# EAGLE design PoEInjector1ChUnregulated (EAGLE 5.09)
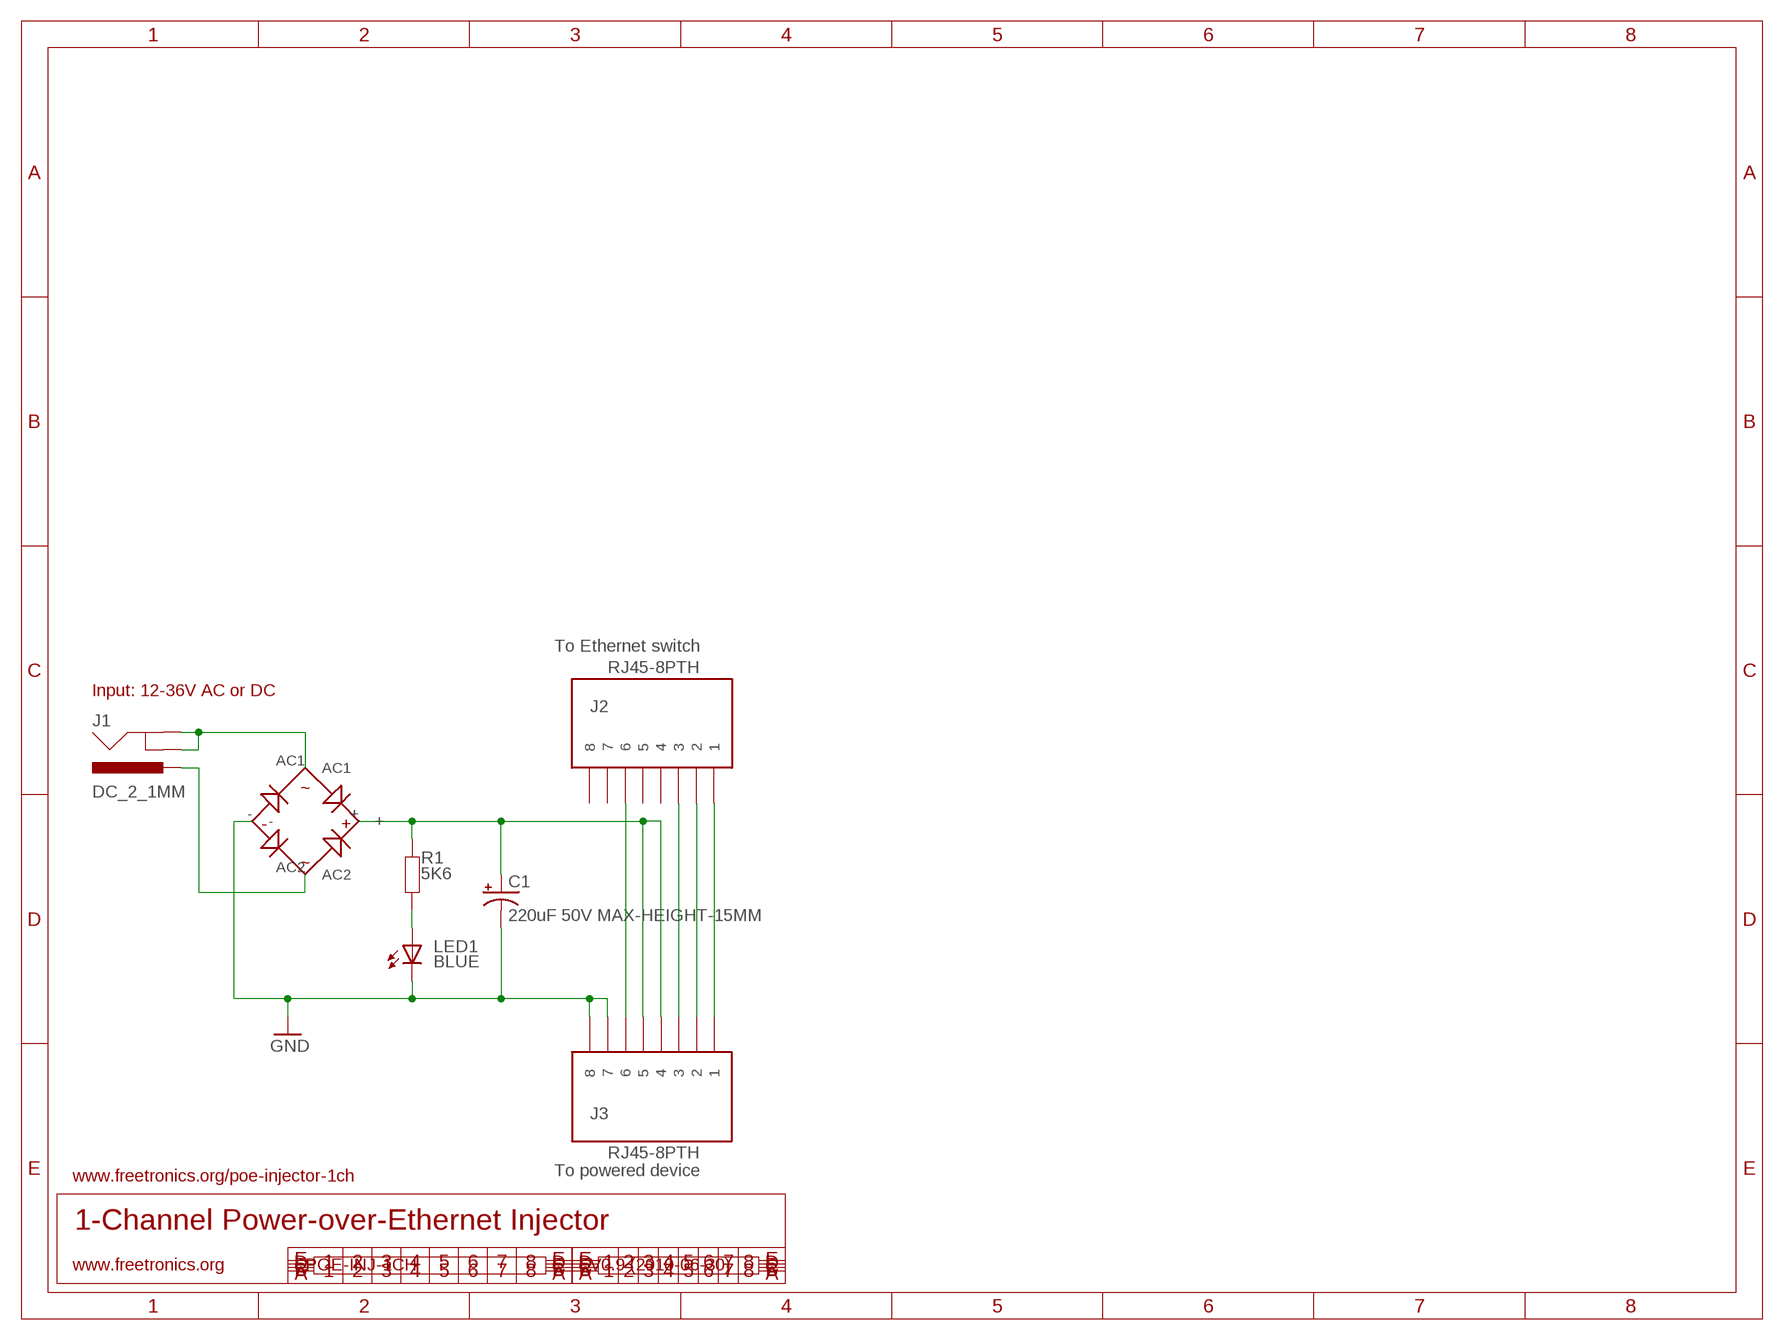
[diagram p0: schematic, sheet 1]

## Parts
BR1  W01G  BRIDGE-RECTIFIERW5-W10  [W5-W10]
C1  220uF 50V MAX-HEIGHT-15MM  CAP_POLPTH4  [CPOL-RADIAL-220UF-50V]
J1  DC_2_1MM  POWER_JACKPTH  [POWER_JACK_PTH]
J2  RJ45-8PTH  [RJ45-8]
J3  RJ45-8PTH  [RJ45-8]
LED1  BLUE  LED3MM  [LED3MM]
R1  5K6  RESISTORPTH4  [RES-4]

## Nets
GND: BR1.- C1.2(-) J3.7 J3.8 LED1.K(C)
N$1: J2.1 J3.1
N$2: J2.2 J3.2
N$3: J2.3 J3.3
N$4: J2.6 J3.6
N$5: BR1.AC1 J1.GND J1.GNDBREAK
N$6: LED1.A R1.2
N$8: BR1.AC2 J1.PWR
VCC: BR1.+ C1.1(+) J3.4 J3.5 R1.1
Unconnected: J2.4 J2.5 J2.7 J2.8

## Notes on the sheet
- To Ethernet switch
- Input: 12-36V AC or DC
- To powered device
- www.freetronics.org/poe-injector-1ch
- 1-Channel Power-over-Ethernet Injector
- www.freetronics.org | POE-INJ-1CH | V0.9 (2010-06-30)

## Library data of the parts
BR1 = freetronics-2:BRIDGE-RECTIFIER
C1 = freetronics-2:CAP_POL: Capacitor Polarized These are standard SMD and PTH capacitors. Normally 10uF, 47uF, and 100uF in electrolytic and tantalum varieties. Always verify the external diameter of the through hole cap, it varies with capacity, voltage, and manufacturer. The EIA devices should be standard.
J1 = freetronics:POWER_JACK: Power Jack This is the standard 5.5mm barrel jack for power. The PTH is the most common, proven, reliable, footprint. All others are experimental. The Slot footprint only works if the mill layer is transmitted to the PCB fab house so be warned. Spark Fun Electronics SKU : PRT-00119. Mating wall wart : TOL-00298 (and others)
J2 J3 = freetronics-2:RJ45-8: RJ45 Jack Simple RJ45, 8-pin connection - connector for common Cat5, Cat5e, and Cat6 Ethernet cables. Footprint not yet proven in production. Connector sku is PRT-00643; Breakout PCB sku is BOB-00716.
LED1 = freetronics-2:LED: LEDs Standard schematic elements and footprints for 5mm, 3mm, 1206, and 0603 sized LEDs. 5mm - Spark Fun Electronics SKU : COM-00529 (and others)
R1 = freetronics-2:RESISTOR: Resistor Basic schematic elements and footprints for 0603, 1206, and PTH 1/10th watt (small) resistors.

## Board
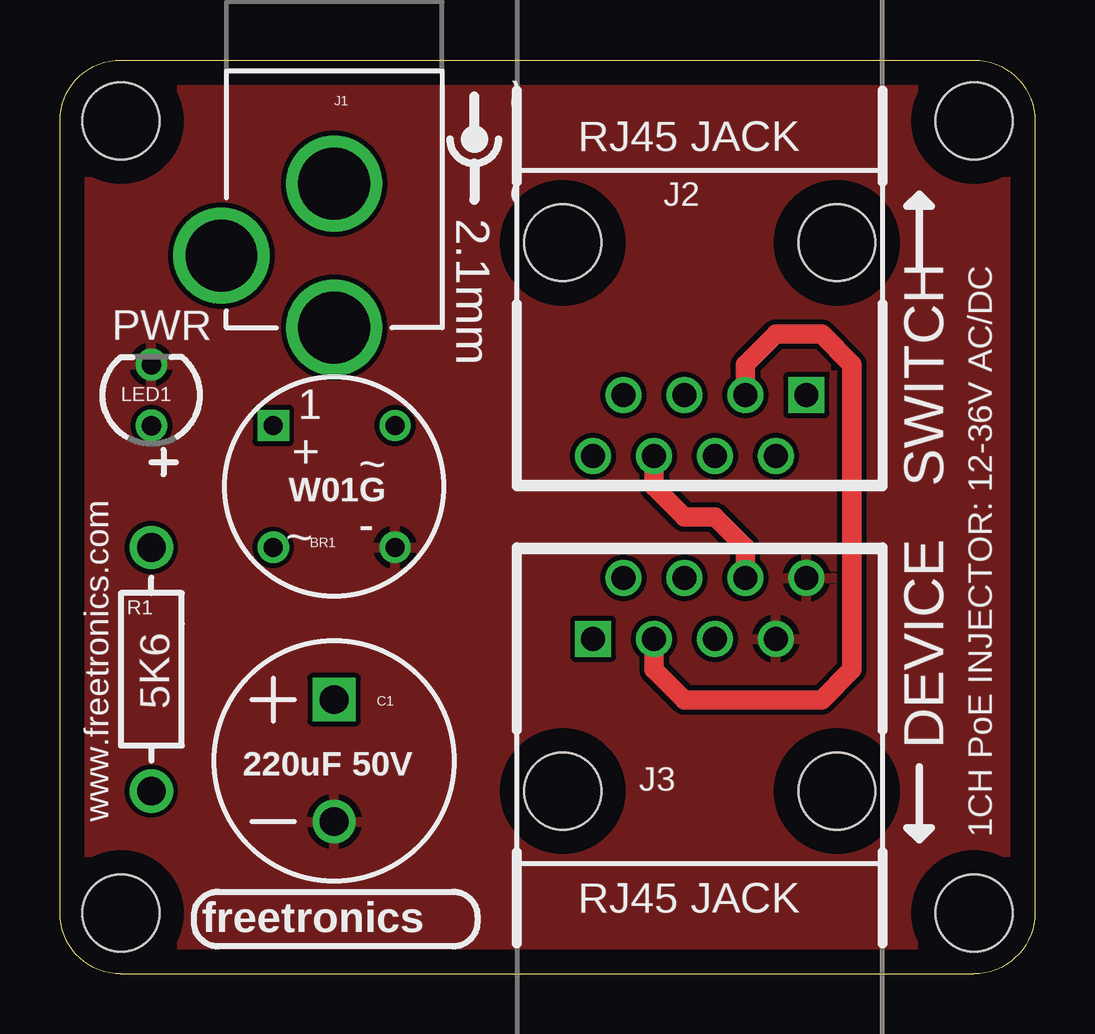
[diagram p1: board, top side]
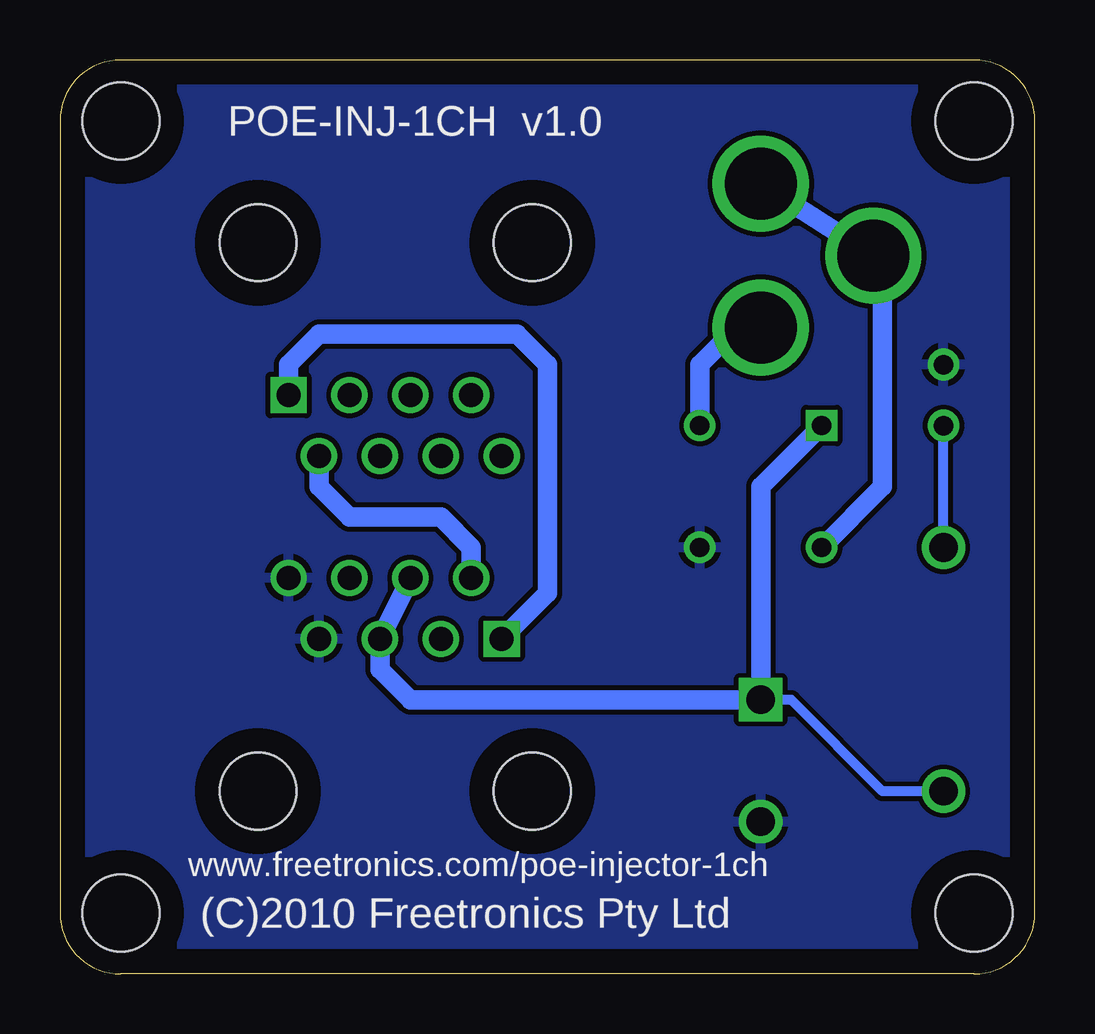
[diagram p2: board, bottom side, seen from below]

Size 40.64 x 38.1 mm. Coordinates in mm from the lower left corner, seen from the top.
Outline: 2.54,0 38.1,0 arc90 40.64,2.54 40.64,35.56 arc90 38.1,38.1 2.54,38.1 arc90 0,35.56 0,2.54 arc90 2.54,0
Copper layers (1*16): Top 0.035mm / dielectric 1.5mm / Bottom 0.035mm
Design rules "default": minimum track width 10mil, minimum drill 24mil, track to track 8mil, track to pad 8mil, pad to pad 8mil, via to via 8mil, smd to smd 8mil, copper to edge 40mil, drill to drill 8mil, minimum pad ring 10mil, minimum via ring 8mil, stop-mask expansion 4mil, vias tented up to drill 0mil, thermal gap 10mil
Holes 3.2 mm at 2.54,2.54 38.1,2.54 38.1,35.56 2.54,35.56

### Footprints (pad centres in the part's own frame; a part is rotated, then mirrored left to right if it is on the bottom)
W5-W10 = drill 0.8 square: + -2.54,2.54 | drill 0.8 round: - 2.54,-2.54; AC1 -2.54,-2.54; AC2 2.54,2.54
CPOL-RADIAL-220UF-50V = drill 1.2 square: 1 0,2.54 | drill 1.2 round: 2 0,-2.54
POWER_JACK_PTH = drill 2.997 round: GND 0,7.7; GNDBREAK 4.7,10.7; PWR 0,13.7
RJ45-8 = drill 1 square: 1 -4.445,6.35 | drill 1 round: 2 -3.175,8.89; 3 -1.905,6.35; 4 -0.635,8.89; 5 0.635,6.35; 6 1.905,8.89; 7 3.175,6.35; 8 4.445,8.89 | hole 3.2: -5.715,0; 5.715,0
LED3MM = drill 0.813 round: A -1.27,0; K 1.27,0
RES-4 = drill 1.2 round: 1 -5.08,0; 2 5.08,0

### Placement (x,y rotation side)
BR1  11.43,20.32 0 top
C1  11.43,8.89 0 top
J1  11.43,40.64 180 top
J2  26.67,30.48 180 top
J3  26.67,7.62 0 top
LED1  3.81,24.13 90 top
R1  3.81,12.7 90 top

### Tracks (layer width: path | path; a pad name or v marks a point on that pad's centre or on a via)
GND
  pour Bottom: 0,2.54 0,35.56 arc-90 2.54,38.1 38.1,38.1 arc-90 40.64,35.56 40.64,2.54 arc-90 38.1,0 2.54,0 arc-90
  pour Top: 38.1,0 2.54,0 arc-90 0,2.54 0,35.56 arc-90 2.54,38.1 38.1,38.1 arc-90 40.64,35.56 40.64,2.54 arc-90
N$1
  Bottom 0.813: J2.1 31.11,25.4 29.84,26.67 21.59,26.67 20.32,25.4 20.32,15.88 J3.1
N$2
  Bottom 0.813: J3.2 23.5,17.78 24.77,19.05 28.57,19.05 29.84,20.32 J2.2
N$3
  Top 0.813: J2.3 28.57,25.4 29.84,26.67 31.75,26.67 33.02,25.4 33.02,12.7 31.75,11.43 26.04,11.43 24.77,12.7 J3.3
N$4
  Top 0.813: J2.6 24.77,20.32 26.04,19.05 27.3,19.05 28.57,17.78 J3.6
N$5
  Bottom 0.813: J1.GND J1.GNDBREAK 6.35,29.21 6.35,20.32 BR1.AC1
N$6
  Bottom 0.406: R1.2 LED1.A
N$8
  Bottom 0.813: J1.PWR 12.7,26.67 13.97,25.4 BR1.AC2
VCC
  Bottom 0.406: R1.1 6.35,7.62 10.16,11.43 C1.1
  Bottom 0.813: J3.4 J3.5 27.3,12.7 26.04,11.43 C1.1 11.43,20.32 BR1.+

### Text on the board
tPlace: ~ | ~ | RJ45 JACK | 2.1mm | PWR | W01G | SWITCH | DEVICE | 220uF 50V | www.freetronics.com | 1CH PoE INJECTOR: 12-36V AC/DC | RJ45 JACK | freetronics
bPlace: POE-INJ-1CH v1.0 | www.freetronics.com/poe-injector-1ch | (C)2010 Freetronics Pty Ltd